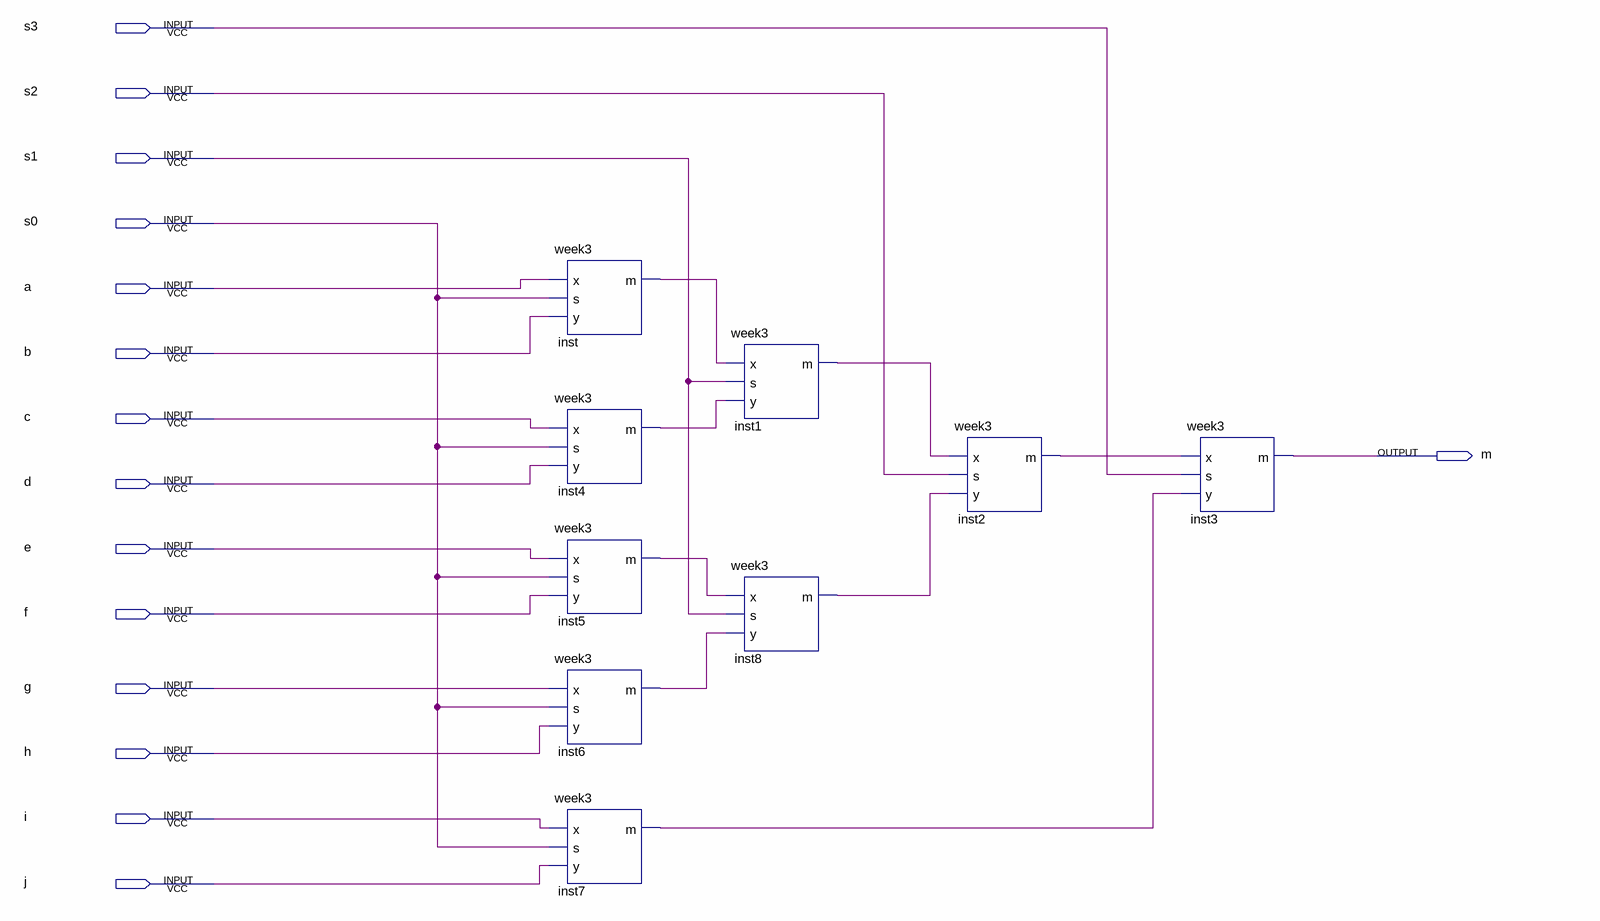
[diagram p0: schematic sheet]
// Quartus schematic 10to1muxweek3.bdf as structural Verilog: 9 symbols, 15 pins
module \10to1muxweek3  (
  input  s3,
  input  s2,
  input  s1,
  input  s0,
  input  a,
  input  b,
  input  c,
  input  d,
  input  e,
  input  f,
  input  g,
  input  h,
  input  i,
  input  j,
  output m
);

  wire inst1_m, inst2_m, inst4_m, inst5_m, inst6_m, inst7_m, inst8_m, inst_m;

  week3 inst (.x(a), .s(s0), .y(b), .m(inst_m));
  week3 inst4 (.x(c), .s(s0), .y(d), .m(inst4_m));
  week3 inst5 (.x(e), .s(s0), .y(f), .m(inst5_m));
  week3 inst6 (.x(g), .s(s0), .y(h), .m(inst6_m));
  week3 inst7 (.x(i), .s(s0), .y(j), .m(inst7_m));
  week3 inst1 (.x(inst_m), .s(s1), .y(inst4_m), .m(inst1_m));
  week3 inst8 (.x(inst5_m), .s(s1), .y(inst6_m), .m(inst8_m));
  week3 inst2 (.x(inst1_m), .s(s2), .y(inst8_m), .m(inst2_m));
  week3 inst3 (.x(inst2_m), .s(s3), .y(inst7_m), .m(m));
endmodule
